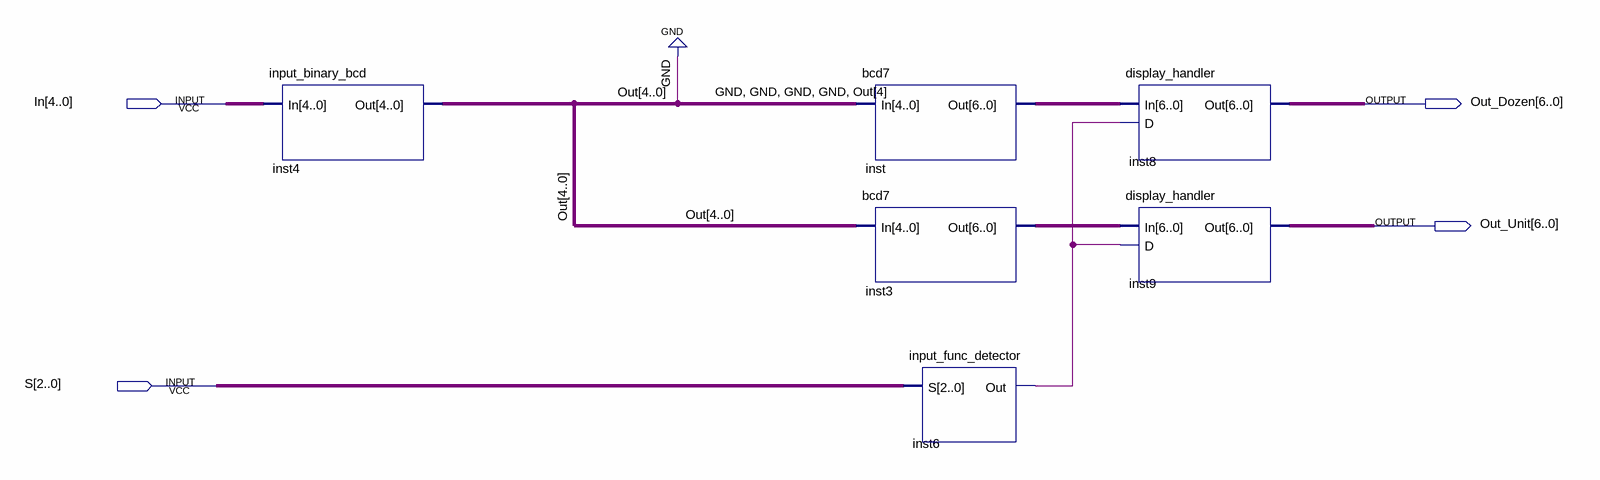
[diagram p0: schematic sheet]
// Quartus schematic input_display.bdf as structural Verilog: 6 symbols, 4 pins
module input_display (
  input  [4:0] In,
  input  [2:0] S,
  output [6:0] Out_Dozen,
  output [6:0] Out_Unit
);

  wire inst6_out;
  wire [4:0] Out;
  wire [6:0] inst3_out, inst_out;

  input_binary_bcd inst4 (.In(In), .Out(Out));
  bcd7 inst (.In({4'b0000, Out[4]}), .Out(inst_out));
  bcd7 inst3 (.In(Out), .Out(inst3_out));
  input_func_detector inst6 (.S(S), .Out(inst6_out));
  display_handler inst8 (.In(inst_out), .D(inst6_out), .Out(Out_Dozen));
  display_handler inst9 (.In(inst3_out), .D(inst6_out), .Out(Out_Unit));
endmodule
